# Altium schematic sheet PreAmplifierBuffer.SchDoc
size A4; SheetNumber: 2; SheetTotal: 5
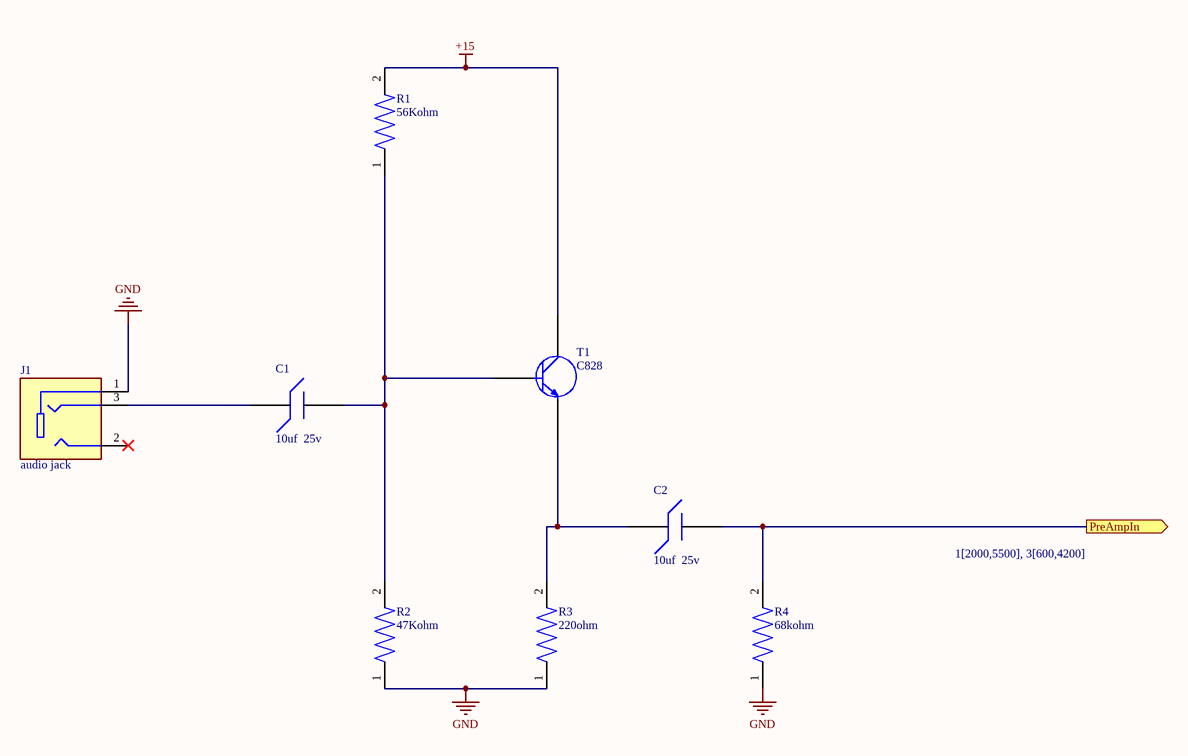
[diagram p0: PreAmplifierBuffer.SchDoc]

## Parts
C1  10uf  25v  [Capasitor]
C2  10uf  25v  [Capasitor]
J1  audio jack  [AudiJack]
R1  56Kohm  [Resistor]
R2  47Kohm  [Resistor]
R3  220ohm  [Resistor]
R4  68kohm  [Resistor]
T1  C828  [transistor]

## Ports
PreAmpIn (out, see 1[2000,5500], 3[600,4200])

## Nets
+15: R1.2 T1.1
GND: J1.1 R2.1 R3.1 R4.1
PreAmpIn: C2.1 R4.2 ; port PreAmpIn
NetC1_1: C1.1 R1.1 R2.2 T1.2
NetC1_2: C1.2 J1.3
NetC2_2: C2.2 R3.2 T1.3

Not connected (* = marked no-connect by the designer): J1 2*

## Library data of the parts
C1 C2 = 25ZLG10MEFC4X7: Aluminum Electrolytic Capacitor, Polarized, Aluminum (wet), 25V, 20% +Tol, 20% -Tol, 10uF, Through Hole Mount; Manufacturer: Rubycon; Dielectric Material: Aluminium; Leakage Current: 7.5uA; Ripple Current: 55.2mA; Tan Delta: 0.14; Supplier: Farnell; Supplier Part Number: 1281813; Manufacturer Part Number: 25ZLG10MEFC4X7; RoHS: Yes; Category: Aluminum Electrolytic Capacitors; Pricing: 10=0.161, 100=0.0857, 500=0.084 (GBP); Mounting Technology: Through Hole; Pins: 2; Package Shape: Cylindrical; Min Operating Temperature: -40°C; Max Operating Temperature: 105°C; Polarity: Polarized; Value: 10uF; Capacitor Type: Aluminium; Tolerance  (fill in as +-): 20%; Package Style: RadialMeter; Packaging: Bulk; Tolerance (fill in as +-): 20%; Rated DC Voltage (URdc): 25V; Termination: Wire; Diameter: 4mm; Length: 7mm; Terminal Pitch: 1.5mm; Reach SVHC Compliant: Yes; RoHS Compliant: Yes; ComponentLink1URL: https://datasheet.ciiva.com:443/pdfs/VipMasterIC/IC/RUBY/RUBY-S-A0008141769/RUBY-S-A0008141769-1.pdf?src-supplier=IHS+Markit; ComponentLink1Description: https://datasheet.ciiva.com:443/pdfs/VipMasterIC/IC/RUBY/RUBY-S-A0008141769/RUBY-S-A0008141769-1.pdf?src-supplier=IHS+Markit; ComponentLink2URL: https://datasheet.ciiva.com/6309/e-zlg-6309557.pdf?src-supplier=Digikey; ComponentLink2Description: https://datasheet.ciiva.com/6309/e-zlg-6309557.pdf?src-supplier=Digikey; ComponentLink3URL: https://datasheet.ciiva.com/11691/e-zlg-11691071.pdf?src-supplier=Avnet; ComponentLink3Description: https://datasheet.ciiva.com/11691/e-zlg-11691071.pdf?src-supplier=Avnet; ComponentLink4URL: https://datasheet.ciiva.com/1455/48838-1455972.pdf?src-supplier=Element14; ComponentLink4Description: https://datasheet.ciiva.com/1455/48838-1455972.pdf?src-supplier=Element14
J1 = SJ1-3523N: 3 Pole(s), Solder Terminal, Jack; Manufacturer: Same Sky; Supplier: Digikey; Supplier Part Number: CP1-3523N-ND; Manufacturer Part Number: SJ1-3523N; RoHS: Yes; Category: Audio / Video Connectors; Stock: 300382; Pricing: 1=0.78, 10=0.665, 25=0.6232, 50=0.5936, 140=0.55193, 280=0.52554, 560=0.50043, 1120=0.47653, 2520=0.46125 (USD); Reach SVHC Compliant: Yes; ComponentLink1URL: https://datasheet.octopart.com/SJ1-3523N-Same-Sky-datasheet-182050170.pdf?src-supplier=Future+Electronics; ComponentLink1Description: https://datasheet.octopart.com/SJ1-3523N-Same-Sky-datasheet-182050170.pdf?src-supplier=Future+Electronics; ComponentLink2URL: https://datasheet.octopart.com/SJ1-3523N-CUI-datasheet-96929.pdf?src-supplier=Digikey; ComponentLink2Description: https://datasheet.octopart.com/SJ1-3523N-CUI-datasheet-96929.pdf?src-supplier=Digikey; ComponentLink3URL: http://www.cui.com/Product/Resource/FuturePDF/SJ1-352XN_Series.pdf?src-supplier=Future+Electronics; ComponentLink3Description: http://www.cui.com/Product/Resource/FuturePDF/SJ1-352XN_Series.pdf?src-supplier=Future+Electronics; ComponentLink4URL: https://datasheet.octopart.com/SJ1-3523N-CUI-Devices-datasheet-103114031.pdf?src-supplier=Master+Electronics; ComponentLink4Description: https://datasheet.octopart.com/SJ1-3523N-CUI-Devices-datasheet-103114031.pdf?src-supplier=Master+Electronics; ComponentLink5URL: https://datasheet.octopart.com/SJ1-3523N-Same-Sky-datasheet-182881325.pdf?src-supplier=Electro+Sonic; ComponentLink5Description: https://datasheet.octopart.com/SJ1-3523N-Same-Sky-datasheet-182881325.pdf?src-supplier=Electro+Sonic
R1 = CF18JT56K0: Fixed Resistor, Carbon Film, 0.125W, 56000ohm, 250V, 5% +/-Tol, -500,0ppm/Cel, Through Hole Mount; Manufacturer: Stackpole Electronics; Power: 125mW; Rated Temperature: 70°C; Value: 56kR; Temperature Coefficient (ppm/Cel): 500; Lead Diameter: 0.4mm; Lead Length: 28mm; Package Length: 3.3mm; Supplier: Digikey; Supplier Part Number: CF18JT56K0CT-ND; Manufacturer Part Number: CF18JT56K0; RoHS: Yes; Category: Through-Hole Resistors; Stock: 85340; Pricing: 1=0.1, 10=0.022, 25=0.0188, 50=0.0162, 100=0.0143, 250=0.01204, 500=0.01062, 1000=0.00943 (USD); Mounting Technology: Through Hole; Pins: 2; Package Shape: Tubular; Terminal Finish: Tin; Min Operating Temperature: -55°C; Max Operating Temperature: 155°C; Tolerance: 5%; JESD-609 Code: e3; Resistor Type: FIXED RESISTOR; Construction: Tubular; Package Style: AXIAL; Packaging: Tape and Reel; Technology: CARBON FILM; Termination: Wire; Working Voltage: 250V; Reach SVHC Compliant: Yes; RoHS Compliant: Yes; ComponentLink1URL: https://datasheet.ciiva.com:443/pdfs/VipMasterIC/IC/SEIE/SEIE-S-A0009883960/SEIE-S-A0009883960-1.pdf?src-supplier=IHS+Markit; ComponentLink1Description: https://datasheet.ciiva.com:443/pdfs/VipMasterIC/IC/SEIE/SEIE-S-A0009883960/SEIE-S-A0009883960-1.pdf?src-supplier=IHS+Markit; ComponentLink2URL: https://www.seielect.com/Catalog/SEI-CF_CFM.pdf?src-supplier=Digikey; ComponentLink2Description: https://www.seielect.com/Catalog/SEI-CF_CFM.pdf?src-supplier=Digikey; ComponentLink3URL: https://www.seielect.com/catalog/SEI-CF_CFM.pdf?src-supplier=Avnet; ComponentLink3Description: https://www.seielect.com/catalog/SEI-CF_CFM.pdf?src-supplier=Avnet
R2 = CF12JT47K0: Fixed Resistor, Carbon Film, 0.5W, 47000ohm, 350V, 5% +/-Tol, -500,0ppm/Cel, Through Hole Mount; Manufacturer: Stackpole Electronics; Power: 500mW; Rated Temperature: 70°C; Value: 47kR; Temperature Coefficient (ppm/Cel): 500; Lead Diameter: 0.55mm; Lead Length: 28mm; Package Length: 8.5mm; Supplier: Digikey; Supplier Part Number: CF12JT47K0CT-ND; Manufacturer Part Number: CF12JT47K0; RoHS: Yes; Category: Through-Hole Resistors; Stock: 190385; Pricing: 1=0.1, 10=0.036, 25=0.0296, 50=0.026, 100=0.0229, 250=0.01936, 500=0.01718, 1000=0.01531 (USD); Mounting Technology: Through Hole; Pins: 2; Package Shape: Tubular; Terminal Finish: Tin; Min Operating Temperature: -55°C; Max Operating Temperature: 155°C; Tolerance: 5%; JESD-609 Code: e3; Resistor Type: FIXED RESISTOR; Construction: Tubular; Package Style: AXIAL; Packaging: Tape and Reel; Technology: CARBON FILM; Termination: Wire; Working Voltage: 350V; Reach SVHC Compliant: Yes; RoHS Compliant: Yes; ComponentLink1URL: https://datasheet.ciiva.com:443/pdfs/VipMasterIC/IC/SEIE/SEIE-S-A0009883960/SEIE-S-A0009883960-1.pdf?src-supplier=IHS+Markit; ComponentLink1Description: https://datasheet.ciiva.com:443/pdfs/VipMasterIC/IC/SEIE/SEIE-S-A0009883960/SEIE-S-A0009883960-1.pdf?src-supplier=IHS+Markit; ComponentLink2URL: http://components.arrow.com/part/dataview/53771568S789882N1174?src-supplier=Arrow+Electronics; ComponentLink2Description: http://components.arrow.com/part/dataview/53771568S789882N1174?src-supplier=Arrow+Electronics; ComponentLink3URL: https://www.seielect.com/catalog/SEI-CF_CFM.pdf?src-supplier=Avnet; ComponentLink3Description: https://www.seielect.com/catalog/SEI-CF_CFM.pdf?src-supplier=Avnet; ComponentLink4URL: https://www.seielect.com/catalog/SEI-Packaging.pdf?src-supplier=Digikey; ComponentLink4Description: https://www.seielect.com/catalog/SEI-Packaging.pdf?src-supplier=Digikey; ComponentLink5URL: http://www.seielect.com/Catalog/SEI-CF_CFM.pdf?src-supplier=Future+Electronics; ComponentLink5Description: http://www.seielect.com/Catalog/SEI-CF_CFM.pdf?src-supplier=Future+Electronics
R3 = S4-220RF1: RES SMD 220 OHM 1% 2W 4525; Manufacturer: Riedon; Supplier: Digikey; Supplier Part Number: 696-S4-220RF1CT-ND; Manufacturer Part Number: S4-220RF1; RoHS: Yes; Category: Chip SMD Resistors; Stock: 180; Pricing: 1=2.38, 10=1.582, 25=1.3652, 50=1.23, 100=1.1147, 250=0.98852, 500=0.90956 (USD); ComponentLink1URL: https://datasheet.ciiva.com/18599/ssl-18599814.pdf?src-supplier=Digikey; ComponentLink1Description: https://datasheet.ciiva.com/18599/ssl-18599814.pdf?src-supplier=Digikey; ComponentLink2URL: https://datasheet.ciiva.com/18599/ssl-18599815.pdf?src-supplier=Digikey; ComponentLink2Description: https://datasheet.ciiva.com/18599/ssl-18599815.pdf?src-supplier=Digikey; ComponentLink3URL: https://datasheet.ciiva.com/18599/ssl-18599816.pdf?src-supplier=Digikey; ComponentLink3Description: https://datasheet.ciiva.com/18599/ssl-18599816.pdf?src-supplier=Digikey
R4 = CF1/4CT52R683J: Fixed Resistor, Carbon Film, 0.25W, 68000ohm, 300V, 5% +/-Tol, -450,350ppm/Cel, Through Hole Mount; Manufacturer: KOA Speer; Power: 250mW; Rated Temperature: 70°C; Value: 68kR; Temperature Coefficient (ppm/Cel): 450; Lead Diameter: 0.6mm; Lead Length: 14mm; Package Length: 6.1mm; Reference Standard: IEC60115-2; Supplier: Digikey; Supplier Part Number: 2019-CF1/4CT52R683JCT-ND; Manufacturer Part Number: CF1/4CT52R683J; RoHS: Yes; Category: Through-Hole Resistors; Stock: 44894; Pricing: 1=0.1, 10=0.046, 25=0.0384, 50=0.0336, 100=0.0296, 250=0.02512, 500=0.0223, 1000=0.01992 (USD); Mounting Technology: Through Hole; Pins: 2; Package Shape: Tubular; Terminal Finish: Copper; Min Operating Temperature: -55°C; Max Operating Temperature: 155°C; Tolerance: 5%; JESD-609 Code: e2; Resistor Type: FIXED RESISTOR; Construction: Cylindrical; Package Style: AXIAL; Packaging: Tape and Reel; Technology: CARBON FILM; Termination: Wire; Working Voltage: 300V; Reach SVHC Compliant: Yes; RoHS Compliant: Yes; ComponentLink1URL: https://datasheet.ciiva.com:443/pdfs/VipMasterIC/IC/KOAS/KOAS-S-A0009586278/KOAS-S-A0009586278-1.pdf?src-supplier=IHS+Markit; ComponentLink1Description: https://datasheet.ciiva.com:443/pdfs/VipMasterIC/IC/KOAS/KOAS-S-A0009586278/KOAS-S-A0009586278-1.pdf?src-supplier=IHS+Markit; ComponentLink2URL: https://datasheet.ciiva.com/5478/cf-5478892.pdf?src-supplier=Mouser; ComponentLink2Description: https://datasheet.ciiva.com/5478/cf-5478892.pdf?src-supplier=Mouser
T1 = SS49E-L: Hall Effect Sensor, -65mT Min, 1-1.75V, Rectangular, Through Hole Mount; Manufacturer: Honeywell Sensing & Control; Output Type: Analog Current; Linearity: -0.7%; Operating Current-Max: 10mA; Sensor Type: MAGNETIC FIELD SENSOR,HALL EFFECT; Max Supply Voltage: 6.5V; Min Supply Voltage: 2.7V; Sensitivity: 1.4mV/g; Body Breadth: 1.6mm; Body Height: 4.1mm; Supplier: Newark; Supplier Part Number: 71J7825; Manufacturer Part Number: SS49E-L; RoHS: Yes; Category: Sensors; Pricing: 1000=5.97 (USD); Mounting Technology: Through Hole; Housing Material: Plastic; Package Shape/Style: Rectangular; Min Operating Temperature: -40°C; Max Operating Temperature: 100°C; Magnetic Field Range-Min: -65mT; Output Range: 1-1.75V; Termination: Solder; Body Length or Diameter: 4.1mm; RoHS Compliant: Yes; ComponentLink1URL: https://datasheet.ciiva.com:443/pdfs/VipMasterIC/IC/HWSC/HWSC-S-A0000795678/HWSC-S-A0000795678-1.pdf?src-supplier=IHS+Markit; ComponentLink1Description: https://datasheet.ciiva.com:443/pdfs/VipMasterIC/IC/HWSC/HWSC-S-A0000795678/HWSC-S-A0000795678-1.pdf?src-supplier=IHS+Markit; ComponentLink2URL: https://datasheet.ciiva.com/15703/honeywell-sensing-ss39et-ss49e-ss59et-productsheet-15703324.pdf?src-supplier=Onlinecomponents.com; ComponentLink2Description: https://datasheet.ciiva.com/15703/honeywell-sensing-ss39et-ss49e-ss59et-productsheet-15703324.pdf?src-supplier=Onlinecomponents.com